# EAGLE schematic main (EAGLE 9.6.2)

## Sheet 1 of 5: Mains PFC
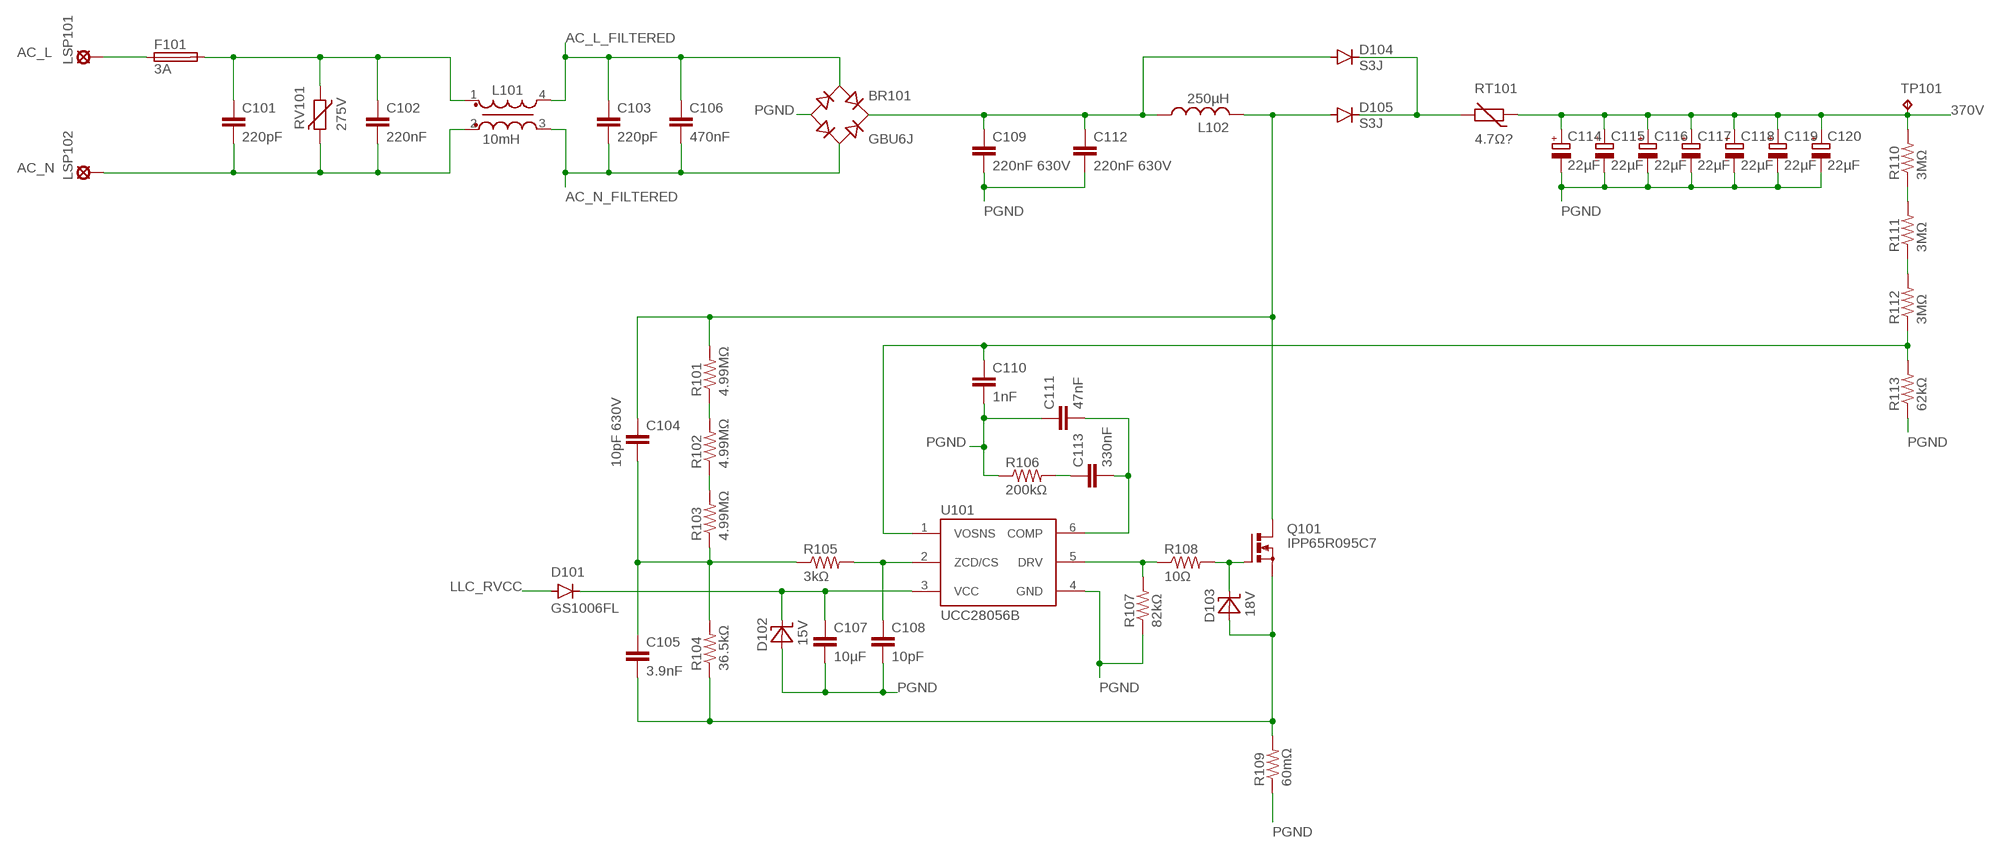
[diagram p0: schematic, sheet 1]

### Parts
BR101  GBU6J  [GBU6]
C101  220pF  C-EU-10MM-TH  [C-10MM-TH]
C102  220nF  WCAP-FTX2-220N  [WCAP-FTX2-220N]
C103  220pF  C-EU-10MM-TH  [C-10MM-TH]
C104  10pF 630V  C-EUC1206  [C1206]
C105  3.9nF  C-EUC0603  [C0603]
C106  470nF  WCAP-FTX2-470N  [WCAP-FTX2-470N]
C107  10µF  C-EUC0805  [C0805]
C108  10pF  C-EUC0603  [C0603]
C109  220nF 630V  C-EUC1812  [C1812]
C110  1nF  C-EUC0603  [C0603]
C111  47nF  C-EUC0603  [C0603]
C112  220nF 630V  C-EUC1812  [C1812]
C113  330nF  C-EUC0603  [C0603]
C114  22µF  CPOL-E5-12.5  [E5-12.5]
C115  22µF  CPOL-E5-12.5  [E5-12.5]
C116  22µF  CPOL-E5-12.5  [E5-12.5]
C117  22µF  CPOL-E5-12.5  [E5-12.5]
C118  22µF  CPOL-E5-12.5  [E5-12.5]
C119  22µF  CPOL-E5-12.5  [E5-12.5]
C120  22µF  CPOL-E5-12.5  [E5-12.5]
D101  GS1006FL  SOD123FL-DIODE  [SOD123FL]
D102  15V  SOD123-ZENER  [SOD123]
D103  18V  SOD123-ZENER  [SOD123]
D104  S3J  DIODE-SMC  [SMC]
D105  S3J  DIODE-SMC  [SMC]
F101  3A  MRF_FUSE  [MRF_FUSE]
L101  10mH  WE-CMB_M_744823210  [WE-CMB_M]
L102  250µH  ATCA-08  [ATCA-08]
LSP101  AC_L  LSP13  [LSP13]
LSP102  AC_N  LSP13  [LSP13]
Q101  IPP65R095C7  TO220BV-HS1-N-MOSFET  [TO220BV-HS1]
R101  4.99MΩ  R-US_R1206  [R1206]
R102  4.99MΩ  R-US_R1206  [R1206]
R103  4.99MΩ  R-US_R1206  [R1206]
R104  36.5kΩ  R-US_R0603  [R0603]
R105  3kΩ  R-US_R0603  [R0603]
R106  200kΩ  R-US_R0603  [R0603]
R107  82kΩ  R-US_R0603  [R0603]
R108  10Ω  R-US_R0603  [R0603]
R109  60mΩ  R-US_R1206  [R1206]
R110  3MΩ  R-US_R1206  [R1206]
R111  3MΩ  R-US_R1206  [R1206]
R112  3MΩ  R-US_R1206  [R1206]
R113  62kΩ  R-US_R0603  [R0603]
RT101  4.7Ω?  THERMISTOR-5  [R-5]
RV101  275V  B72207S0271  [B72207S0271]
TP101  RCU-0(J)  [TP_0603_JOINED]
U101  UCC28056B  [SOT23-6L]

### Nets
370V [HV]: C114.+ C115.+ C116.+ C117.+ C118.+ C119.+ C120.+ R110.2 RT101.1 TP101.1(TP) ; also sheet 2
AC_L [HV]: F101.1 LSP101.MP
AC_L_FILTERED [HV]: BR101.2(AC1) C103.1 C106.1 L101.4 ; also sheet 2
AC_L_FUSED [HV]: C101.1 C102.1 F101.2 L101.1 RV101.1
AC_N [HV]: C101.2 C102.2 L101.2 LSP102.MP RV101.2
AC_N_FILTERED [HV]: BR101.3(AC2) C103.2 C106.2 L101.3 ; also sheet 2
AC_RECTIFIED [HV]: BR101.4(+) C109.1 C112.1 D104.A L102.1
LLC_RVCC [primary]: D101.A ; also sheet 2
PFC_COMP [primary]: C111.2 C113.2 U101.6(COMP)
PFC_COMP_INT [primary]: C113.1 R106.2
PFC_CS [primary]: C105.2 D103.A Q101.S R104.1 R109.2
PFC_DRV [primary]: R107.2 R108.1 U101.5(DRV)
PFC_DRV_R [primary]: D103.C Q101.G R108.2
PFC_OUT_RAW [HV]: D104.C D105.C RT101.2
PFC_SW_NODE [HV]: C104.1 D105.A L102.2 Q101.D R101.2
PFC_VCC [primary]: C107.1 D101.C D102.C U101.3(VCC)
PFC_VOSNS [primary]: C110.1 R112.1 R113.2 U101.1(VOSNS)
PFC_VOSNS_RB [HV]: R111.1 R112.2
PFC_VOSNS_RT [HV]: R110.1 R111.2
PFC_ZCD/CS [primary]: C108.1 R105.2 U101.2(ZCD/CS)
PFC_ZCD/CS_RAW [primary]: C104.2 C105.1 R103.1 R104.2 R105.1
PFC_ZCD_RB [HV]: R102.1 R103.2
PFC_ZCD_RT [HV]: R101.1 R102.2
PGND [primary]: BR101.1(-) C107.2 C108.2 C109.2 C110.2 C111.1 C112.2 C114.- C115.- C116.- C117.- C118.- C119.- C120.- D102.A R106.1 R107.1 R109.1 R113.1 U101.4(GND) ; also sheet 2

## Sheet 2 of 5: LLC
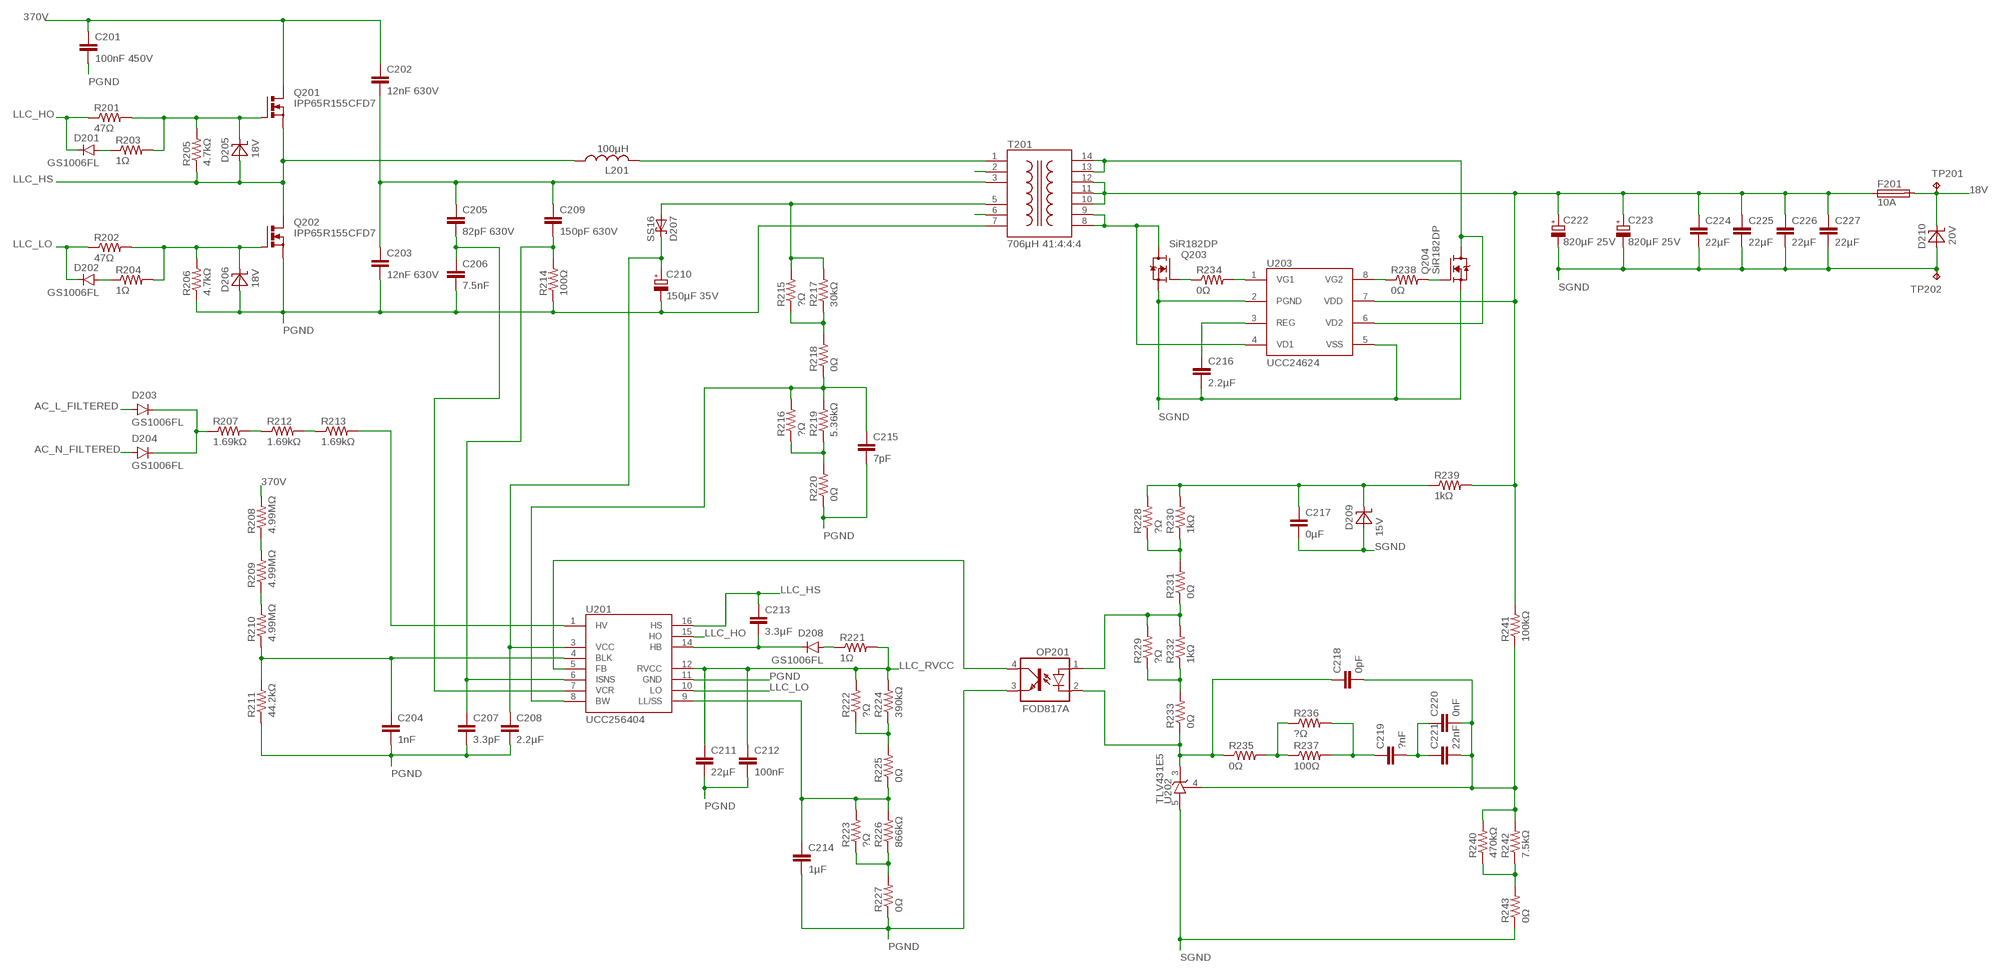
[diagram p1: schematic, sheet 2]

### Parts
C201  100nF 450V  C-EUC1206  [C1206]
C202  12nF 630V  C-EUC1210  [C1210]
C203  12nF 630V  C-EUC1210  [C1210]
C204  1nF  C-EUC0603  [C0603]
C205  82pF 630V  C-EUC1206  [C1206]
C206  7.5nF  C-EUC0603  [C0603]
C207  3.3pF  C-EUC0603  [C0603]
C208  2.2µF  C-EUC0805  [C0805]
C209  150pF 630V  C-EUC1206  [C1206]
C210  150µF 35V  CPOL-EUE  [PANASONIC_E]
C211  22µF  C-EUC0805  [C0805]
C212  100nF  C-EUC0603  [C0603]
C213  3.3µF  C-EUC0805  [C0805]
C214  1µF  C-EUC0603  [C0603]
C215  7pF  C-EUC0603  [C0603]
C216  2.2µF  C-EUC0805  [C0805]
C217  0µF  C-EUC0603  [C0603]
C218  0pF  C-EUC0603  [C0603]
C219  ?nF  C-EUC0603  [C0603]
C220  0nF  C-EUC0603  [C0603]
C221  22nF  C-EUC0603  [C0603]
C222  820µF 25V  CPOL-EUE5-10.5  [E5-10,5]
C223  820µF 25V  CPOL-EUE5-10.5  [E5-10,5]
C224  22µF  C-EUC0805  [C0805]
C225  22µF  C-EUC0805  [C0805]
C226  22µF  C-EUC0805  [C0805]
C227  22µF  C-EUC0805  [C0805]
D201  GS1006FL  SOD123FL-DIODE  [SOD123FL]
D202  GS1006FL  SOD123FL-DIODE  [SOD123FL]
D203  GS1006FL  SOD123FL-DIODE  [SOD123FL]
D204  GS1006FL  SOD123FL-DIODE  [SOD123FL]
D205  18V  SOD123-ZENER  [SOD123]
D206  18V  SOD123-ZENER  [SOD123]
D207  SS16  DO-214AC-SCHOTTKY  [DO-214AC]
D208  GS1006FL  SOD123FL-DIODE  [SOD123FL]
D209  15V  SOD123-ZENER  [SOD123]
D210  20V  SOD123-ZENER  [SOD123]
F201  10A  MRF_FUSE  [MRF_FUSE]
L201  100µH  HCTI-1MM  [HCTI-1MM]
OP201  FOD817A  DIP4-OPTOCOUPLER  [DIP4]
Q201  IPP65R155CFD7  TO220BV-HS1-N-MOSFET  [TO220BV-HS1]
Q202  IPP65R155CFD7  TO220BV-HS1-N-MOSFET  [TO220BV-HS1]
Q203  SiR182DP  POWERPAK-SO8-N-MOSFET  [POWERPAK-SO8]
Q204  SiR182DP  POWERPAK-SO8-N-MOSFET  [POWERPAK-SO8]
R201  47Ω  R-US_R0603  [R0603]
R202  47Ω  R-US_R0603  [R0603]
R203  1Ω  R-US_R0603  [R0603]
R204  1Ω  R-US_R0603  [R0603]
R205  4.7kΩ  R-US_R0603  [R0603]
R206  4.7kΩ  R-US_R0603  [R0603]
R207  1.69kΩ  R-US_R1206  [R1206]
R208  4.99MΩ  R-US_R1206  [R1206]
R209  4.99MΩ  R-US_R1206  [R1206]
R210  4.99MΩ  R-US_R1206  [R1206]
R211  44.2kΩ  R-US_R0603  [R0603]
R212  1.69kΩ  R-US_R1206  [R1206]
R213  1.69kΩ  R-US_R1206  [R1206]
R214  100Ω  R-US_R1206  [R1206]
R215  ?Ω  R-US_R0603  [R0603]
R216  ?Ω  R-US_R0603  [R0603]
R217  30kΩ  R-US_R0603  [R0603]
R218  0Ω  R-US_R0603  [R0603]
R219  5.36kΩ  R-US_R0603  [R0603]
R220  0Ω  R-US_R0603  [R0603]
R221  1Ω  R-US_R0603  [R0603]
R222  ?Ω  R-US_R0603  [R0603]
R223  ?Ω  R-US_R0603  [R0603]
R224  390kΩ  R-US_R0603  [R0603]
R225  0Ω  R-US_R0603  [R0603]
R226  866kΩ  R-US_R0603  [R0603]
R227  0Ω  R-US_R0603  [R0603]
R228  ?Ω  R-US_R0603  [R0603]
R229  ?Ω  R-US_R0603  [R0603]
R230  1kΩ  R-US_R0603  [R0603]
R231  0Ω  R-US_R0603  [R0603]
R232  1kΩ  R-US_R0603  [R0603]
R233  0Ω  R-US_R0603  [R0603]
R234  0Ω  R-US_R0603  [R0603]
R235  0Ω  R-US_R0603  [R0603]
R236  ?Ω  R-US_R0603  [R0603]
R237  100Ω  R-US_R0603  [R0603]
R238  0Ω  R-US_R0603  [R0603]
R239  1kΩ  R-US_R0603  [R0603]
R240  470kΩ  R-US_R0603  [R0603]
R241  100kΩ  R-US_R0603  [R0603]
R242  7.5kΩ  R-US_R0603  [R0603]
R243  0Ω  R-US_R0603  [R0603]
T201  706µH 41:4:4:4  ETD29/16/10-H  [ETD29/16/10-H]
TP201  RCU-0(J)  [TP_0603_JOINED]
TP202  RCU-0(J)  [TP_0603_JOINED]
U201  UCC256404  [SOIC16-NO2,13]
U202  TLV431E5  [SOT23-5L]
U203  UCC24624  [SOIC8]

### Nets
18V: D210.C F201.2 TP201.1(TP) ; also sheet 3,4,5
370V [HV]: C201.1 C202.1 Q201.D R208.2 ; also sheet 1
AC_L_FILTERED [HV]: D203.A ; also sheet 1
AC_N_FILTERED [HV]: D204.A ; also sheet 1
LLC_AUX [primary]: D207.A R215.2 R217.2 T201.5
LLC_BLK [primary]: C204.1 R210.1 R211.2 U201.4(BLK)
LLC_BLK_RB [HV]: R209.1 R210.2
LLC_BLK_RT [HV]: R208.1 R209.2
LLC_BW [primary]: C215.1 R216.2 R218.1 R219.2 U201.8(BW)
LLC_BW_RB [primary]: R216.1 R219.1 R220.2
LLC_BW_RT [primary]: R215.1 R217.1 R218.2
LLC_FB [primary]: OP201.4(COL) U201.5(FB)
LLC_FB_COMP: C219.1 R236.2 R237.2
LLC_FB_COMPC: C219.2 C220.1 C221.1
LLC_FB_COMPR: R235.2 R236.1 R237.1
LLC_FB_OPA: OP201.1(A) R229.2 R231.1 R232.2
LLC_FB_OPAP: C217.1 D209.C R228.2 R230.2 R239.1
LLC_FB_OPAR: R228.1 R230.1 R231.2
LLC_FB_OPBR: R229.1 R232.1 R233.2
LLC_FB_OPK: C218.1 OP201.2(C) R233.1 R235.1 U202.3(C)
LLC_FB_VREF: C218.2 C220.2 C221.2 R240.2 R241.1 R242.2 U202.4(R)
LLC_FB_VREFR: R240.1 R242.1 R243.2
LLC_HB [HV]: C213.2 D208.C U201.14(HB)
LLC_HB_FEED [primary]: D208.A R221.1
LLC_HO [HV]: D201.C R201.1 U201.15(HO)
LLC_HO_DIS [HV]: D201.A R203.1
LLC_HO_R [HV]: D205.C Q201.G R201.2 R203.2 R205.2
LLC_HS [HV]: C213.1 D205.A L201.1 Q201.S Q202.D R205.1 U201.16(HS)
LLC_HV [HV]: R213.2 U201.1(HV)
LLC_HV_RB [HV]: R212.2 R213.1
LLC_HV_RECT [HV]: D203.C D204.C R207.1
LLC_HV_RT [HV]: R207.2 R212.1
LLC_ISNS [primary]: C207.1 C209.2 R214.2 U201.6(ISNS)
LLC_LL/SS [primary]: C214.1 R223.2 R225.1 R226.2 U201.9(LL/SS)
LLC_LL_RB [primary]: R223.1 R226.1 R227.2
LLC_LL_RT [primary]: R222.1 R224.1 R225.2
LLC_LO [primary]: D202.C R202.1 U201.10(LO)
LLC_LO_DIS [primary]: D202.A R204.1
LLC_LO_R [primary]: D206.C Q202.G R202.2 R204.2 R206.2
LLC_OUT: C222.+ C223.+ C224.1 C225.1 C226.1 C227.1 F201.1 R239.2 R241.2 T201.10 T201.11 T201.12 U203.7(VDD)
LLC_PRI_IN [HV]: L201.2 T201.1
LLC_PRI_OUT [HV]: C202.2 C203.1 C205.1 C209.1 T201.3
LLC_RVCC [primary]: C211.1 C212.1 R221.2 R222.2 R224.2 U201.12(RVCC) ; also sheet 1
LLC_SR_REG: C216.1 U203.3(REG)
LLC_SR_VD1: Q203.5-8(D) T201.8 T201.9 U203.4(VD1)
LLC_SR_VD2: Q204.5-8(D) T201.13 T201.14 U203.6(VD2)
LLC_SR_VG1: R234.2 U203.1(VG1)
LLC_SR_VG1_R: Q203.4(G) R234.1
LLC_SR_VG2: R238.1 U203.8(VG2)
LLC_SR_VG2_R: Q204.4(G) R238.2
LLC_VCC [primary]: C208.1 C210.+ D207.C U201.3(VCC)
LLC_VCR [primary]: C205.2 C206.1 U201.7(VCR)
PGND [primary]: C201.2 C203.2 C204.2 C206.2 C207.2 C208.2 C210.- C211.2 C212.2 C214.2 C215.2 D206.A OP201.3(EMIT) Q202.S R206.1 R211.1 R214.1 R220.1 R227.1 T201.7 U201.11(GND) ; also sheet 1
PRI_DUMMY_1 [HV]: T201.2
PRI_DUMMY_2 [primary]: T201.6
SGND: C216.2 C217.2 C222.- C223.- C224.2 C225.2 C226.2 C227.2 D209.A D210.A Q203.1(S) Q203.2(S) Q203.3(S) Q204.1(S) Q204.2(S) Q204.3(S) R243.1 TP202.1(TP) U202.5(A) U203.2(PGND) U203.5(VSS) ; also sheet 3,4,5

## Sheet 3 of 5: USB-C Port 1
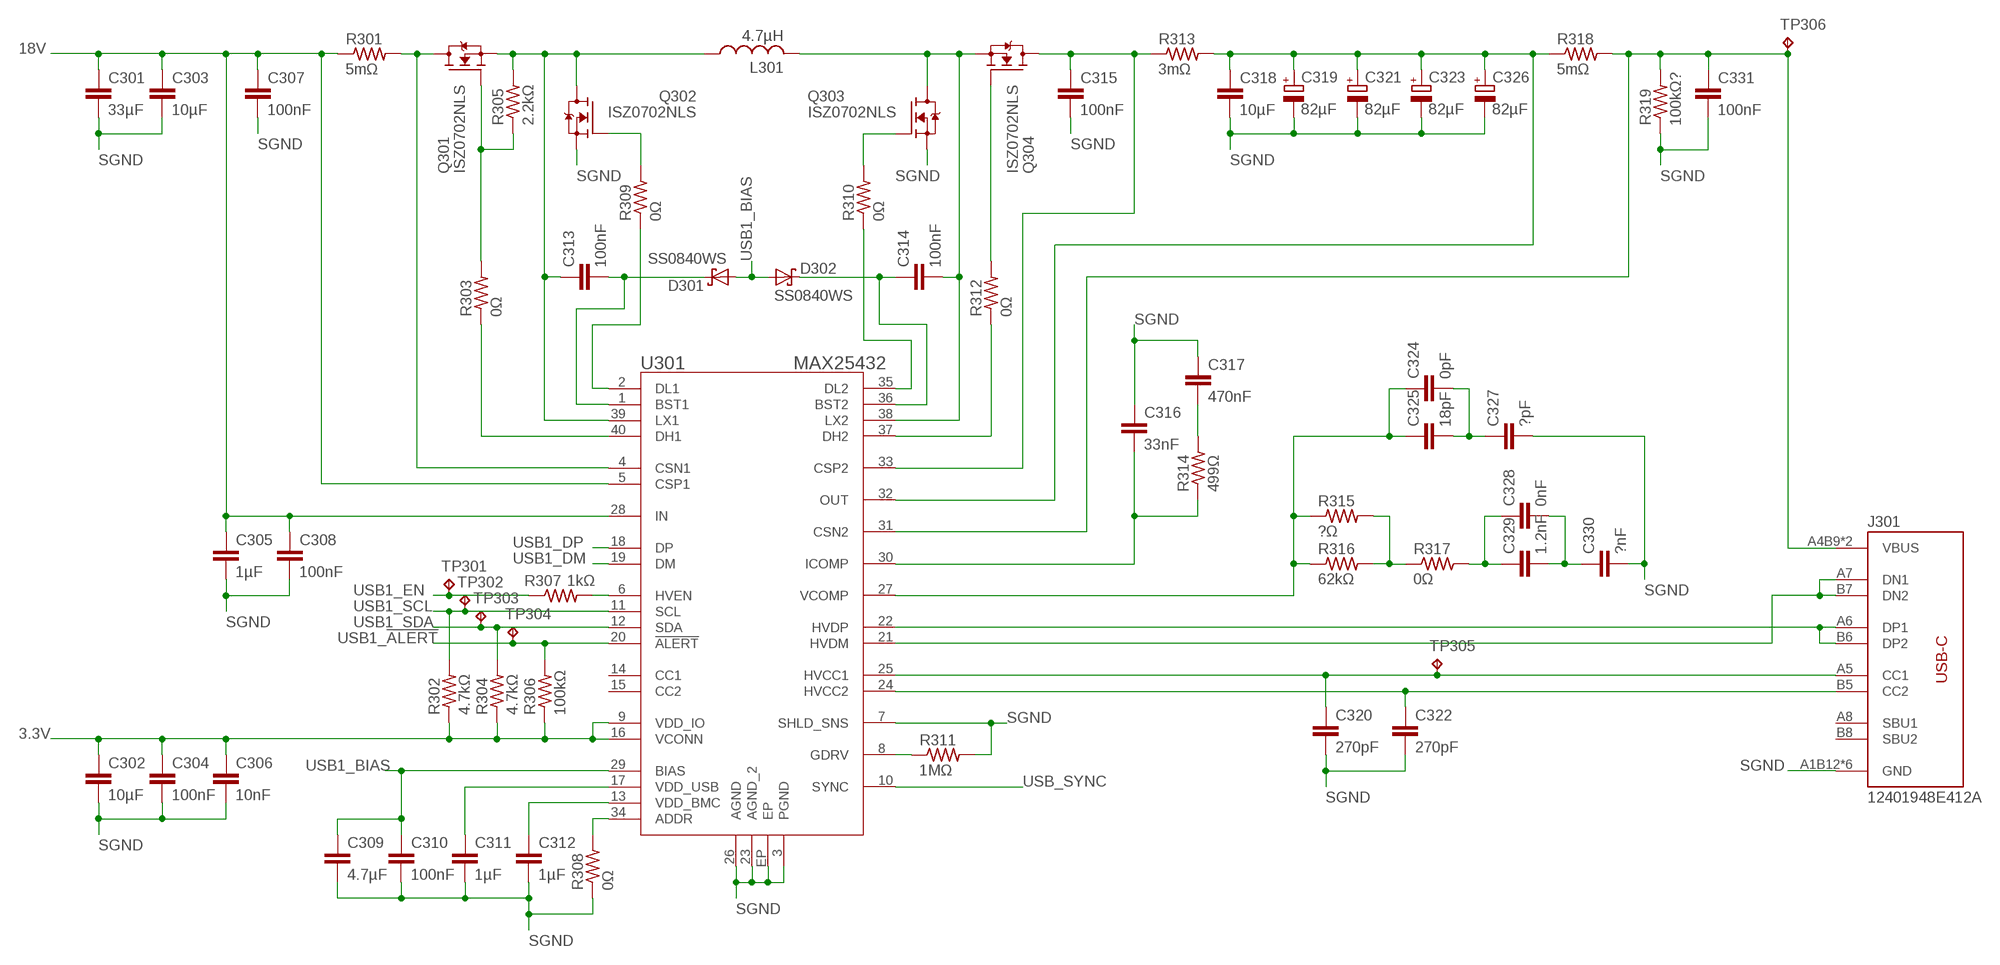
[diagram p2: schematic, sheet 3]

### Parts
C301  33µF  C-EUC1206  [C1206]
C302  10µF  C-EUC0805  [C0805]
C303  10µF  C-EUC0805  [C0805]
C304  100nF  C-EUC0603  [C0603]
C305  1µF  C-EUC0603  [C0603]
C306  10nF  C-EUC0603  [C0603]
C307  100nF  C-EUC0603  [C0603]
C308  100nF  C-EUC0603  [C0603]
C309  4.7µF  C-EUC0603  [C0603]
C310  100nF  C-EUC0603  [C0603]
C311  1µF  C-EUC0603  [C0603]
C312  1µF  C-EUC0603  [C0603]
C313  100nF  C-EUC0603  [C0603]
C314  100nF  C-EUC0603  [C0603]
C315  100nF  C-EUC0603  [C0603]
C316  33nF  C-EUC0603  [C0603]
C317  470nF  C-EUC0603  [C0603]
C318  10µF  C-EUC0805  [C0805]
C319  82µF  CPOL-EUE3.5-8  [E3,5-8]
C320  270pF  C-EUC0603  [C0603]
C321  82µF  CPOL-EUE3.5-8  [E3,5-8]
C322  270pF  C-EUC0603  [C0603]
C323  82µF  CPOL-EUE3.5-8  [E3,5-8]
C324  0pF  C-EUC0603  [C0603]
C325  18pF  C-EUC0603  [C0603]
C326  82µF  CPOL-EUE3.5-8  [E3,5-8]
C327  ?pF  C-EUC0603  [C0603]
C328  0nF  C-EUC0603  [C0603]
C329  1.2nF  C-EUC0603  [C0603]
C330  ?nF  C-EUC0603  [C0603]
C331  100nF  C-EUC0603  [C0603]
D301  SS0840WS  SOD323-SCHOTTKY  [SOD323]
D302  SS0840WS  SOD323-SCHOTTKY  [SOD323]
J301  12401948E412A  [12401948E412A]
L301  4.7µH  B82559BA016  [B82559B*A016]
Q301  ISZ0702NLS  TSDSON-8-N-MOSFET  [TSDSON-8]
Q302  ISZ0702NLS  TSDSON-8-N-MOSFET  [TSDSON-8]
Q303  ISZ0702NLS  TSDSON-8-N-MOSFET  [TSDSON-8]
Q304  ISZ0702NLS  TSDSON-8-N-MOSFET  [TSDSON-8]
R301  5mΩ  R-US_R0805  [R0805]
R302  4.7kΩ  R-US_R0603  [R0603]
R303  0Ω  R-US_R0603  [R0603]
R304  4.7kΩ  R-US_R0603  [R0603]
R305  2.2kΩ  R-US_R0603  [R0603]
R306  100kΩ  R-US_R0603  [R0603]
R307  1kΩ  R-US_R0603  [R0603]
R308  0Ω  R-US_R0603  [R0603]
R309  0Ω  R-US_R0603  [R0603]
R310  0Ω  R-US_R0603  [R0603]
R311  1MΩ  R-US_R0603  [R0603]
R312  0Ω  R-US_R0603  [R0603]
R313  3mΩ  R-US_R0805  [R0805]
R314  499Ω  R-US_R0603  [R0603]
R315  ?Ω  R-US_R0603  [R0603]
R316  62kΩ  R-US_R0603  [R0603]
R317  0Ω  R-US_R0603  [R0603]
R318  5mΩ  R-US_R0805  [R0805]
R319  100kΩ?  R-US_R0603  [R0603]
TP301  RCU-0(J)  [TP_0603_JOINED]
TP302  RCU-0(J)  [TP_0603_JOINED]
TP303  RCU-0(J)  [TP_0603_JOINED]
TP304  RCU-0(J)  [TP_0603_JOINED]
TP305  RCU-0(J)  [TP_0603_JOINED]
TP306  RCU-0(J)  [TP_0603_JOINED]
U301  MAX25432  [TQFN-40]

### Nets
3.3V: C302.1 C304.1 C306.1 R302.1 R304.1 R306.1 U301.9(VDD_IO) U301.16(VCONN) ; also sheet 4,5
18V: C301.1 C303.1 C305.1 C307.1 C308.1 R301.1 U301.5(CSP1) U301.28(IN) ; also sheet 2,4,5
SGND: C301.2 C302.2 C303.2 C304.2 C305.2 C306.2 C307.2 C308.2 C309.2 C310.2 C311.2 C312.2 C315.2 C316.1 C317.1 C318.2 C319.- C320.2 C321.- C322.2 C323.- C326.- C327.2 C330.2 C331.2 J301.A1B12(GND) J301.B1A12(GND) J301.M1(GND) J301.M2(GND) J301.M3(GND) J301.M4(GND) Q302.1(S) Q302.2(S) Q302.3(S) Q303.1(S) Q303.2(S) Q303.3(S) R308.1 R311.2 R319.1 U301.3(PGND) U301.7(SHLD_SNS) U301.23(AGND_2) U301.26(AGND) U301.EP ; also sheet 2,4,5
USB1_!ALERT: R306.2 TP304.1(TP) U301.20(!ALERT) ; also sheet 5
USB1_ADDR: R308.2 U301.34(ADDR)
USB1_BIAS: C309.1 C310.1 D301.2(A) D302.2(A) U301.29(BIAS)
USB1_BST1: C313.2 D301.1(C) U301.1(BST1)
USB1_BST2: C314.1 D302.1(C) U301.36(BST2)
USB1_CC1: C320.1 J301.A5(CC1) TP305.1(TP) U301.25(HVCC1)
USB1_CC2: C322.1 J301.B5(CC2) U301.24(HVCC2)
USB1_CSN1: Q301.5-8(D) R301.2 U301.4(CSN1)
USB1_CSP2: C315.1 Q304.5-8(D) R313.1 U301.33(CSP2)
USB1_DH1: R303.1 U301.40(DH1)
USB1_DH1_R: Q301.4(G) R303.2 R305.1
USB1_DH2: R312.1 U301.37(DH2)
USB1_DH2_R: Q304.4(G) R312.2
USB1_DL1: R309.1 U301.2(DL1)
USB1_DL1_R: Q302.4(G) R309.2
USB1_DL2: R310.1 U301.35(DL2)
USB1_DL2_R: Q303.4(G) R310.2
USB1_DM: U301.19(DM) ; also sheet 5
USB1_DP: U301.18(DP) ; also sheet 5
USB1_EN: R307.1 TP301.1(TP) ; also sheet 5
USB1_GDRV: R311.1 U301.8(GDRV)
USB1_HVDM: J301.A7(DN1) J301.B7(DN2) U301.21(HVDM)
USB1_HVDP: J301.A6(DP1) J301.B6(DP2) U301.22(HVDP)
USB1_HVEN: R307.2 U301.6(HVEN)
USB1_ICOMP: C316.2 R314.1 U301.30(ICOMP)
USB1_ICOMP_R: C317.2 R314.2
USB1_LX1: C313.1 L301.1 Q301.1(S) Q301.2(S) Q301.3(S) Q302.5-8(D) R305.2 U301.39(LX1)
USB1_LX2: C314.2 L301.2 Q303.5-8(D) Q304.1(S) Q304.2(S) Q304.3(S) U301.38(LX2)
USB1_OUT: C318.1 C319.+ C321.+ C323.+ C326.+ R313.2 R318.1 U301.32(OUT)
USB1_SCL: R302.2 TP302.1(TP) U301.11(SCL) ; also sheet 5
USB1_SDA: R304.2 TP303.1(TP) U301.12(SDA) ; also sheet 5
USB1_VBUS: C331.1 J301.A4B9(VBUS) J301.B4A9(VBUS) R318.2 R319.2 TP306.1(TP) U301.31(CSN2)
USB1_VCOMP: C324.1 C325.1 R315.1 R316.1 U301.27(VCOMP)
USB1_VCOMP_CPI: C324.2 C325.2 C327.1
USB1_VCOMP_CZI: C328.2 C329.2 C330.1
USB1_VCOMP_R: C328.1 C329.1 R317.2
USB1_VCOMP_RI: R315.2 R316.2 R317.1
USB1_VDD_BMC: C312.1 U301.13(VDD_BMC)
USB1_VDD_USB: C311.1 U301.17(VDD_USB)
USB_SYNC: U301.10(SYNC) ; also sheet 4
Unconnected: J301.A8(SBU1) J301.B8(SBU2) U301.14(CC1) U301.15(CC2)

## Sheet 4 of 5: USB-C Port 2
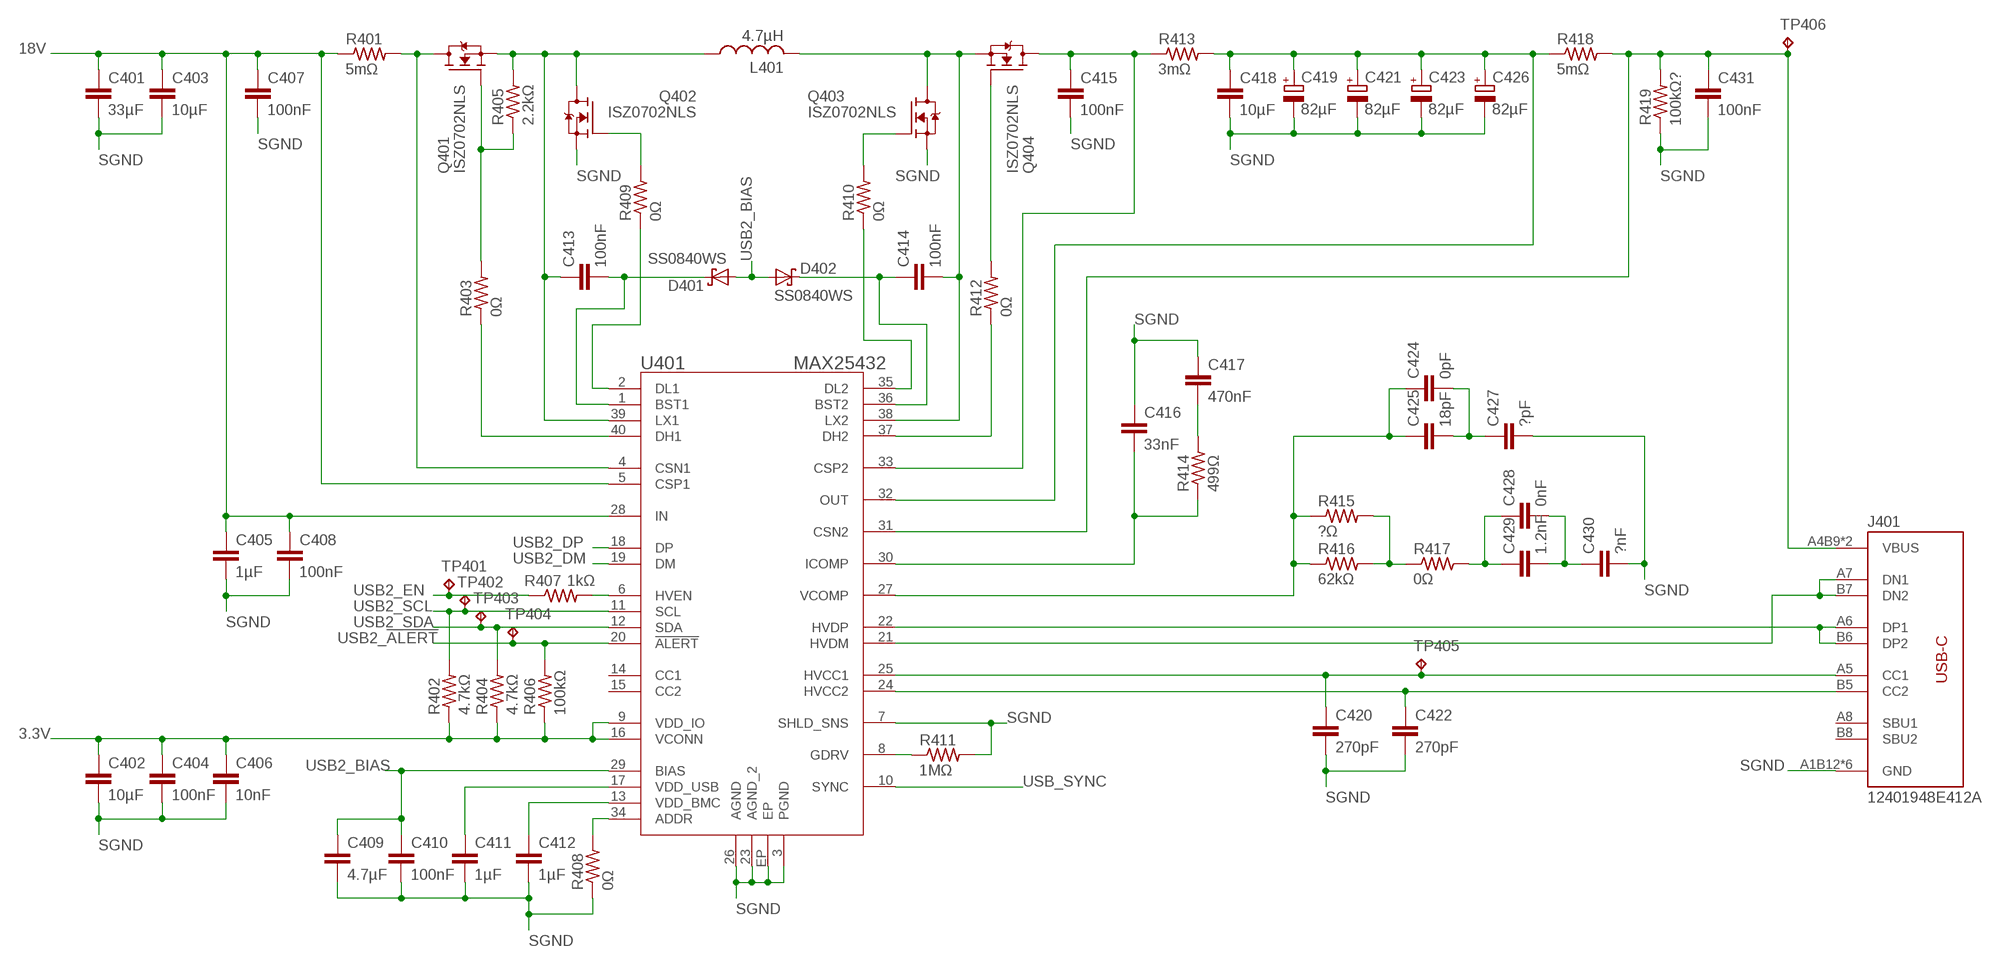
[diagram p3: schematic, sheet 4]

### Parts
C401  33µF  C-EUC1206  [C1206]
C402  10µF  C-EUC0805  [C0805]
C403  10µF  C-EUC0805  [C0805]
C404  100nF  C-EUC0603  [C0603]
C405  1µF  C-EUC0603  [C0603]
C406  10nF  C-EUC0603  [C0603]
C407  100nF  C-EUC0603  [C0603]
C408  100nF  C-EUC0603  [C0603]
C409  4.7µF  C-EUC0603  [C0603]
C410  100nF  C-EUC0603  [C0603]
C411  1µF  C-EUC0603  [C0603]
C412  1µF  C-EUC0603  [C0603]
C413  100nF  C-EUC0603  [C0603]
C414  100nF  C-EUC0603  [C0603]
C415  100nF  C-EUC0603  [C0603]
C416  33nF  C-EUC0603  [C0603]
C417  470nF  C-EUC0603  [C0603]
C418  10µF  C-EUC0805  [C0805]
C419  82µF  CPOL-EUE3.5-8  [E3,5-8]
C420  270pF  C-EUC0603  [C0603]
C421  82µF  CPOL-EUE3.5-8  [E3,5-8]
C422  270pF  C-EUC0603  [C0603]
C423  82µF  CPOL-EUE3.5-8  [E3,5-8]
C424  0pF  C-EUC0603  [C0603]
C425  18pF  C-EUC0603  [C0603]
C426  82µF  CPOL-EUE3.5-8  [E3,5-8]
C427  ?pF  C-EUC0603  [C0603]
C428  0nF  C-EUC0603  [C0603]
C429  1.2nF  C-EUC0603  [C0603]
C430  ?nF  C-EUC0603  [C0603]
C431  100nF  C-EUC0603  [C0603]
D401  SS0840WS  SOD323-SCHOTTKY  [SOD323]
D402  SS0840WS  SOD323-SCHOTTKY  [SOD323]
J401  12401948E412A  [12401948E412A]
L401  4.7µH  B82559BA016  [B82559B*A016]
Q401  ISZ0702NLS  TSDSON-8-N-MOSFET  [TSDSON-8]
Q402  ISZ0702NLS  TSDSON-8-N-MOSFET  [TSDSON-8]
Q403  ISZ0702NLS  TSDSON-8-N-MOSFET  [TSDSON-8]
Q404  ISZ0702NLS  TSDSON-8-N-MOSFET  [TSDSON-8]
R401  5mΩ  R-US_R0805  [R0805]
R402  4.7kΩ  R-US_R0603  [R0603]
R403  0Ω  R-US_R0603  [R0603]
R404  4.7kΩ  R-US_R0603  [R0603]
R405  2.2kΩ  R-US_R0603  [R0603]
R406  100kΩ  R-US_R0603  [R0603]
R407  1kΩ  R-US_R0603  [R0603]
R408  0Ω  R-US_R0603  [R0603]
R409  0Ω  R-US_R0603  [R0603]
R410  0Ω  R-US_R0603  [R0603]
R411  1MΩ  R-US_R0603  [R0603]
R412  0Ω  R-US_R0603  [R0603]
R413  3mΩ  R-US_R0805  [R0805]
R414  499Ω  R-US_R0603  [R0603]
R415  ?Ω  R-US_R0603  [R0603]
R416  62kΩ  R-US_R0603  [R0603]
R417  0Ω  R-US_R0603  [R0603]
R418  5mΩ  R-US_R0805  [R0805]
R419  100kΩ?  R-US_R0603  [R0603]
TP401  RCU-0(J)  [TP_0603_JOINED]
TP402  RCU-0(J)  [TP_0603_JOINED]
TP403  RCU-0(J)  [TP_0603_JOINED]
TP404  RCU-0(J)  [TP_0603_JOINED]
TP405  RCU-0(J)  [TP_0603_JOINED]
TP406  RCU-0(J)  [TP_0603_JOINED]
U401  MAX25432  [TQFN-40]

### Nets
3.3V: C402.1 C404.1 C406.1 R402.1 R404.1 R406.1 U401.9(VDD_IO) U401.16(VCONN) ; also sheet 3,5
18V: C401.1 C403.1 C405.1 C407.1 C408.1 R401.1 U401.5(CSP1) U401.28(IN) ; also sheet 2,3,5
SGND: C401.2 C402.2 C403.2 C404.2 C405.2 C406.2 C407.2 C408.2 C409.2 C410.2 C411.2 C412.2 C415.2 C416.1 C417.1 C418.2 C419.- C420.2 C421.- C422.2 C423.- C426.- C427.2 C430.2 C431.2 J401.A1B12(GND) J401.B1A12(GND) J401.M1(GND) J401.M2(GND) J401.M3(GND) J401.M4(GND) Q402.1(S) Q402.2(S) Q402.3(S) Q403.1(S) Q403.2(S) Q403.3(S) R408.1 R411.2 R419.1 U401.3(PGND) U401.7(SHLD_SNS) U401.23(AGND_2) U401.26(AGND) U401.EP ; also sheet 2,3,5
USB2_!ALERT: R406.2 TP404.1(TP) U401.20(!ALERT) ; also sheet 5
USB2_ADDR: R408.2 U401.34(ADDR)
USB2_BIAS: C409.1 C410.1 D401.2(A) D402.2(A) U401.29(BIAS)
USB2_BST1: C413.2 D401.1(C) U401.1(BST1)
USB2_BST2: C414.1 D402.1(C) U401.36(BST2)
USB2_CC1: C420.1 J401.A5(CC1) TP405.1(TP) U401.25(HVCC1)
USB2_CC2: C422.1 J401.B5(CC2) U401.24(HVCC2)
USB2_CSN1: Q401.5-8(D) R401.2 U401.4(CSN1)
USB2_CSP2: C415.1 Q404.5-8(D) R413.1 U401.33(CSP2)
USB2_DH1: R403.1 U401.40(DH1)
USB2_DH1_R: Q401.4(G) R403.2 R405.1
USB2_DH2: R412.1 U401.37(DH2)
USB2_DH2_R: Q404.4(G) R412.2
USB2_DL1: R409.1 U401.2(DL1)
USB2_DL1_R: Q402.4(G) R409.2
USB2_DL2: R410.1 U401.35(DL2)
USB2_DL2_R: Q403.4(G) R410.2
USB2_DM: U401.19(DM) ; also sheet 5
USB2_DP: U401.18(DP) ; also sheet 5
USB2_EN: R407.1 TP401.1(TP) ; also sheet 5
USB2_GDRV: R411.1 U401.8(GDRV)
USB2_HVDM: J401.A7(DN1) J401.B7(DN2) U401.21(HVDM)
USB2_HVDP: J401.A6(DP1) J401.B6(DP2) U401.22(HVDP)
USB2_HVEN: R407.2 U401.6(HVEN)
USB2_ICOMP: C416.2 R414.1 U401.30(ICOMP)
USB2_ICOMP_R: C417.2 R414.2
USB2_LX1: C413.1 L401.1 Q401.1(S) Q401.2(S) Q401.3(S) Q402.5-8(D) R405.2 U401.39(LX1)
USB2_LX2: C414.2 L401.2 Q403.5-8(D) Q404.1(S) Q404.2(S) Q404.3(S) U401.38(LX2)
USB2_OUT: C418.1 C419.+ C421.+ C423.+ C426.+ R413.2 R418.1 U401.32(OUT)
USB2_SCL: R402.2 TP402.1(TP) U401.11(SCL) ; also sheet 5
USB2_SDA: R404.2 TP403.1(TP) U401.12(SDA) ; also sheet 5
USB2_VBUS: C431.1 J401.A4B9(VBUS) J401.B4A9(VBUS) R418.2 R419.2 TP406.1(TP) U401.31(CSN2)
USB2_VCOMP: C424.1 C425.1 R415.1 R416.1 U401.27(VCOMP)
USB2_VCOMP_CPI: C424.2 C425.2 C427.1
USB2_VCOMP_CZI: C428.2 C429.2 C430.1
USB2_VCOMP_R: C428.1 C429.1 R417.2
USB2_VCOMP_RI: R415.2 R416.2 R417.1
USB2_VDD_BMC: C412.1 U401.13(VDD_BMC)
USB2_VDD_USB: C411.1 U401.17(VDD_USB)
USB_SYNC: U401.10(SYNC) ; also sheet 3
Unconnected: J401.A8(SBU1) J401.B8(SBU2) U401.14(CC1) U401.15(CC2)

## Sheet 5 of 5
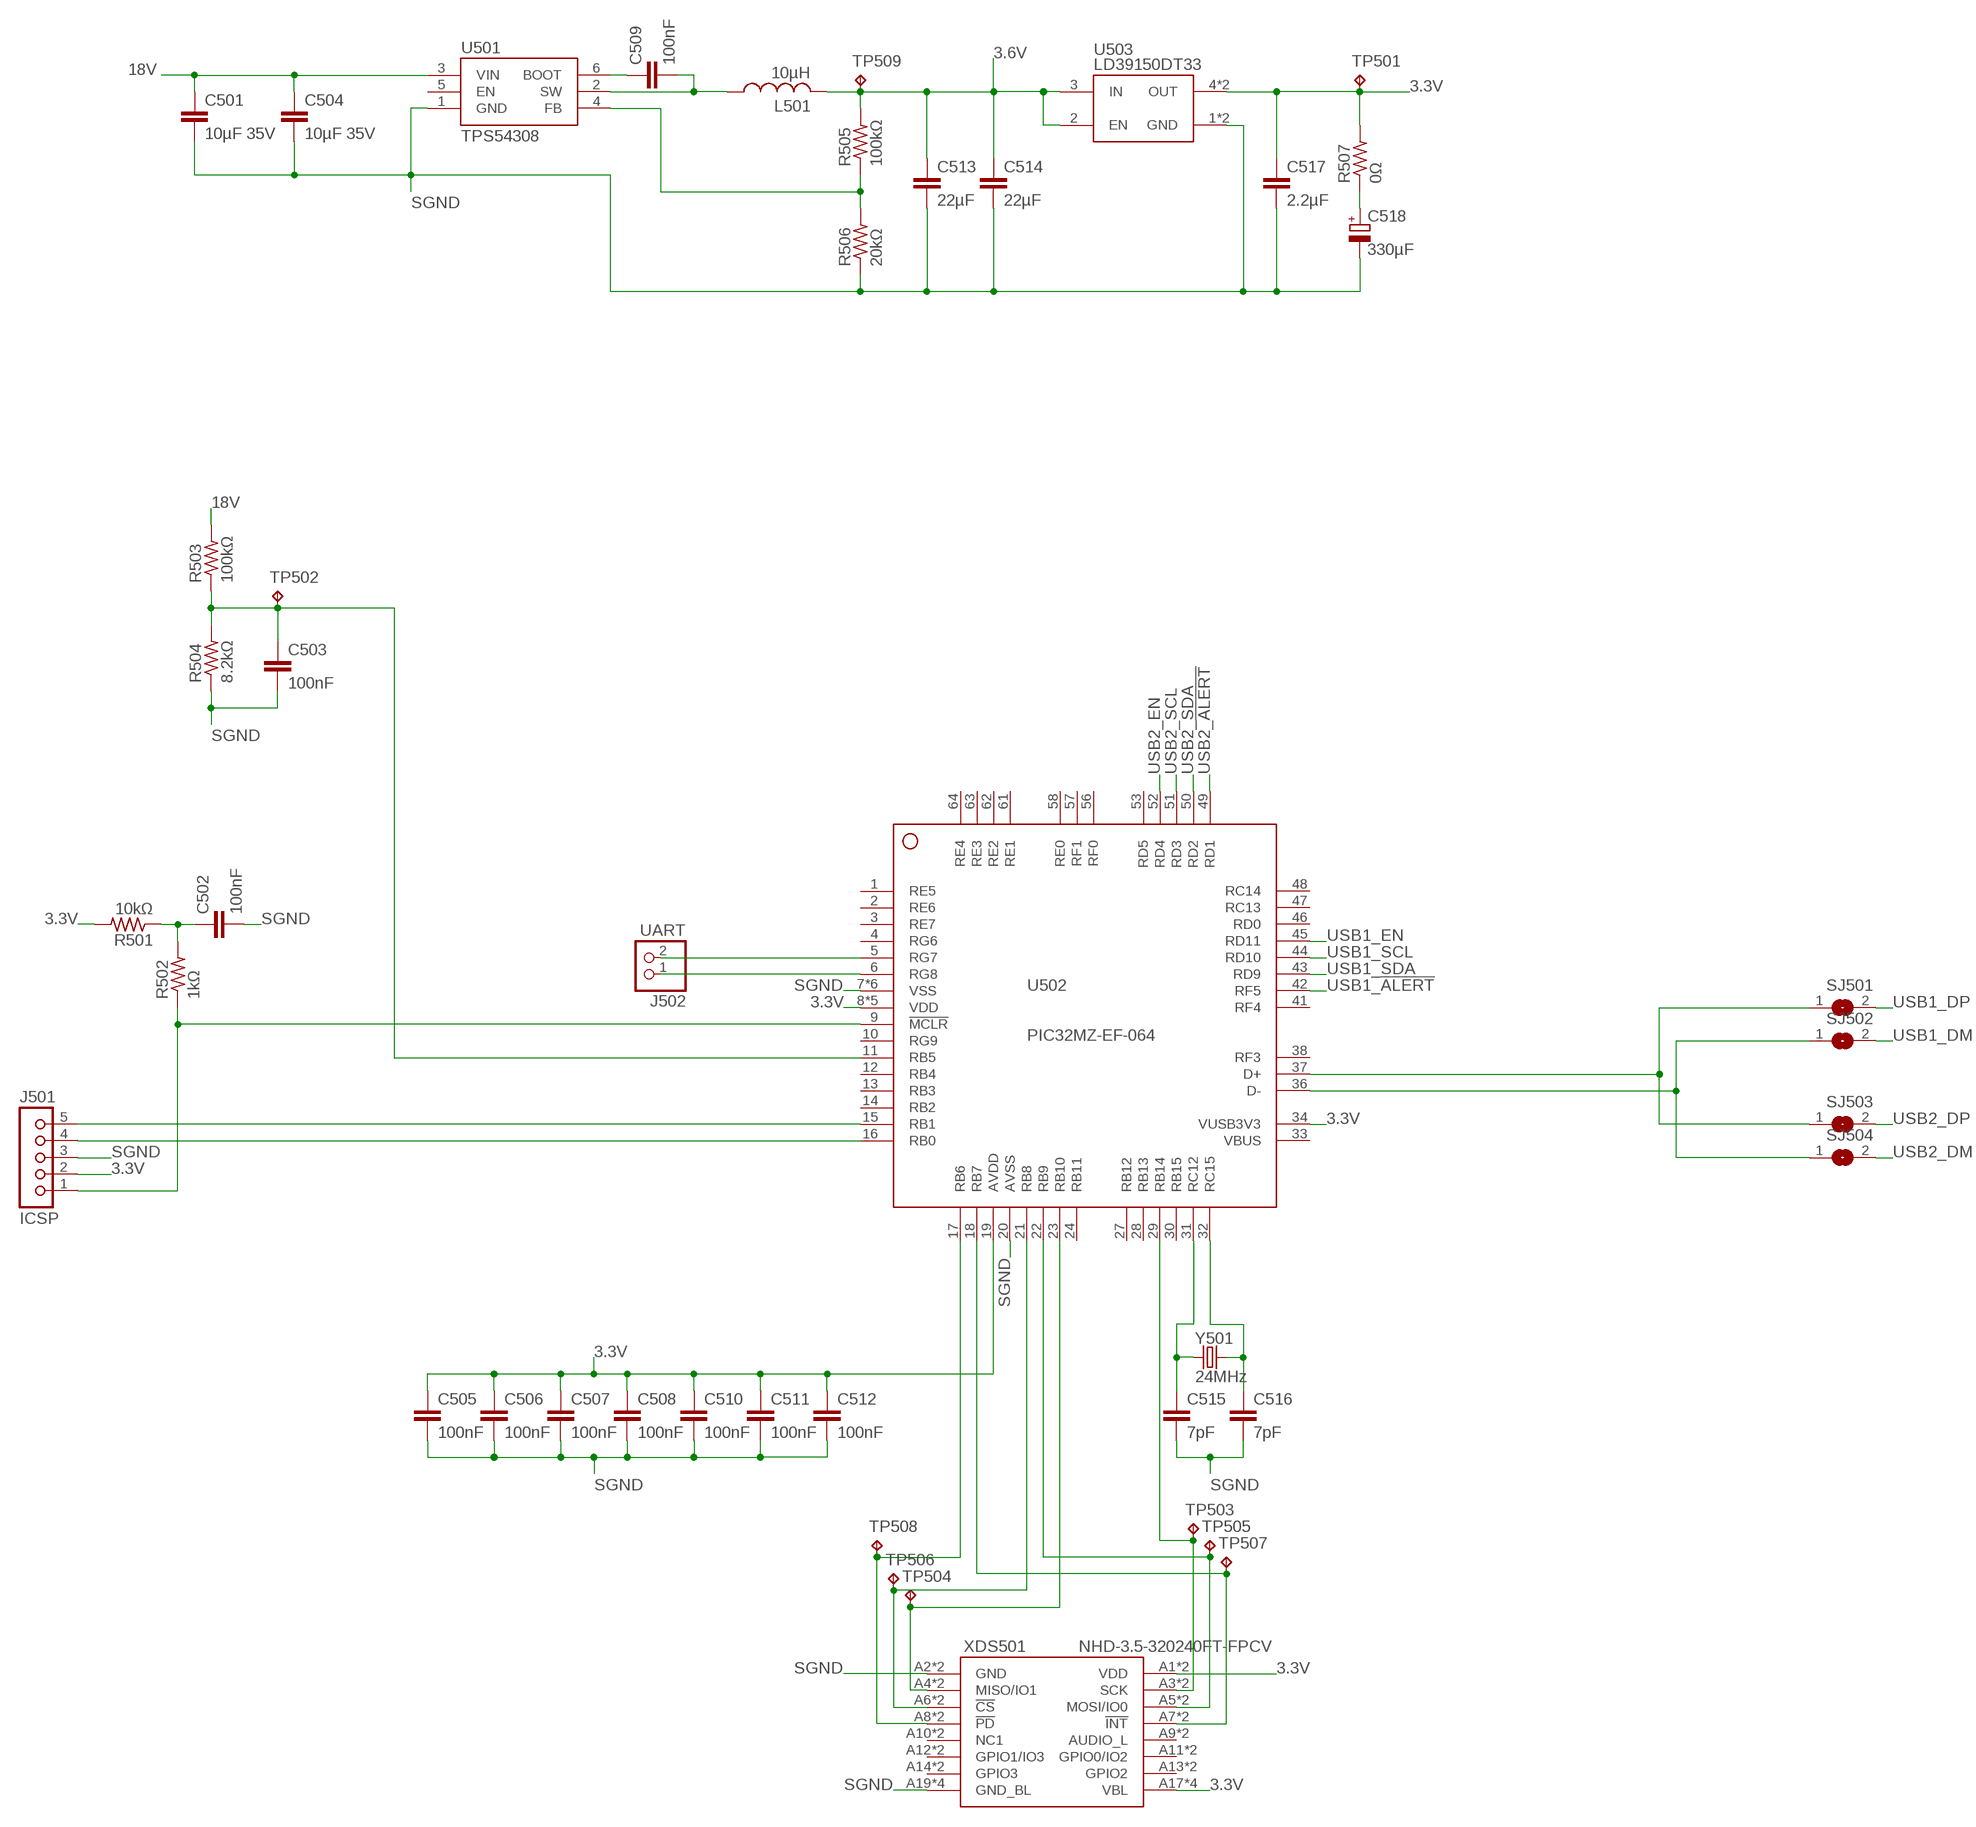
[diagram p4: schematic, sheet 5]

### Parts
C501  10µF 35V  C-EUC1206  [C1206]
C502  100nF  C-EUC0603  [C0603]
C503  100nF  C-EUC0603  [C0603]
C504  10µF 35V  C-EUC1206  [C1206]
C505  100nF  C-EUC0603  [C0603]
C506  100nF  C-EUC0603  [C0603]
C507  100nF  C-EUC0603  [C0603]
C508  100nF  C-EUC0603  [C0603]
C509  100nF  C-EUC0603  [C0603]
C510  100nF  C-EUC0603  [C0603]
C511  100nF  C-EUC0603  [C0603]
C512  100nF  C-EUC0603  [C0603]
C513  22µF  C-EUC0805  [C0805]
C514  22µF  C-EUC0805  [C0805]
C515  7pF  C-EUC0603  [C0603]
C516  7pF  C-EUC0603  [C0603]
C517  2.2µF  C-EUC0805  [C0805]
C518  330µF  CPOL-EUD  [PANASONIC_D]
J501  ICSP  5PIN-1.27  [5PIN-1.27]
J502  UART  PINHD-1X2  [1X02]
L501  10µH  RLB0912  [RLB0912]
R501  10kΩ  R-US_R0603  [R0603]
R502  1kΩ  R-US_R0603  [R0603]
R503  100kΩ  R-US_R0603  [R0603]
R504  8.2kΩ  R-US_R0603  [R0603]
R505  100kΩ  R-US_R0603  [R0603]
R506  20kΩ  R-US_R0603  [R0603]
R507  0Ω  R-US_R0603  [R0603]
SJ501  SJ  [SJ]
SJ502  SJ  [SJ]
SJ503  SJ  [SJ]
SJ504  SJ  [SJ]
TP501  RCU-0(J)  [TP_0603_JOINED]
TP502  RCU-0(J)  [TP_0603_JOINED]
TP503  RCU-0(J)  [TP_0603_JOINED]
TP504  RCU-0(J)  [TP_0603_JOINED]
TP505  RCU-0(J)  [TP_0603_JOINED]
TP506  RCU-0(J)  [TP_0603_JOINED]
TP507  RCU-0(J)  [TP_0603_JOINED]
TP508  RCU-0(J)  [TP_0603_JOINED]
TP509  RCU-0(J)  [TP_0603_JOINED]
U501  TPS54308  [SOT23-6L]
U502  PIC32MZ-EF-064  [TQFP64-10X10X1MM]
U503  LD39150DT33  DFN6-LDO  [DFN6]
XDS501  NHD-3.5-320240FT-FPCV  [FFC3A20-20]
Y501  24MHz  XRCGB-CRYSTAL  [XRCGB]

### Nets
3.3V: C505.1 C506.1 C507.1 C508.1 C510.1 C511.1 C512.1 C517.1 J501.2 R501.2 R507.2 TP501.1(TP) U502.8(VDD) U502.19(AVDD) U502.26(VDD) U502.34(VUSB3V3) U502.39(VDD) U502.54(VDD) U502.60(VDD) U503.4(OUT) U503.5(OUT) XDS501.A1(VDD) XDS501.A17(VBL) XDS501.A18(VBL) XDS501.B1(VDD) XDS501.B17(VBL) XDS501.B18(VBL) ; also sheet 3,4
3.3V_BULKR: C518.+ R507.1
3.6V: C513.1 C514.1 L501.2 R505.2 TP509.1(TP) U503.2(EN) U503.3(IN)
18V: C501.1 C504.1 R503.2 U501.3(VIN) ; also sheet 2,3,4
LCD_!CS: TP506.1(TP) U502.21(RB8) XDS501.A6(!CS) XDS501.B6(!CS)
LCD_!INT: TP507.1(TP) U502.18(RB7) XDS501.A7(!INT) XDS501.B7(!INT)
LCD_!PD: TP508.1(TP) U502.17(RB6) XDS501.A8(!PD) XDS501.B8(!PD)
LCD_MISO: TP504.1(TP) U502.23(RB10) XDS501.A4(MISO/IO1) XDS501.B4(MISO/IO1)
LCD_MOSI: TP505.1(TP) U502.22(RB9) XDS501.A5(MOSI/IO0) XDS501.B5(MOSI/IO0)
LCD_SCK: TP503.1(TP) U502.29(RB14) XDS501.A3(SCK) XDS501.B3(SCK)
PIC_!MCLR: J501.1 R502.1 U502.9(!MCLR)
PIC_!MCLR!_FILTER: C502.1 R501.1 R502.2
PIC_D+: SJ501.1 SJ503.1 U502.37(D+)
PIC_D-: SJ502.1 SJ504.1 U502.36(D-)
PIC_OSC1: C515.1 U502.31(RC12) Y501.1
PIC_OSC2: C516.1 U502.32(RC15) Y501.3
PIC_PGEC: J501.5 U502.15(RB1)
PIC_PGED: J501.4 U502.16(RB0)
PIC_UART_RX: J502.1 U502.6(RG8)
PIC_UART_TX: J502.2 U502.5(RG7)
PIC_VIN_SENSE: C503.1 R503.1 R504.2 TP502.1(TP) U502.11(RB5)
PRELIN_BOOT: C509.1 U501.6(BOOT)
PRELIN_FB: R505.1 R506.2 U501.4(FB)
PRELIN_SW: C509.2 L501.1 U501.2(SW)
SGND: C501.2 C502.2 C503.2 C504.2 C505.2 C506.2 C507.2 C508.2 C510.2 C511.2 C512.2 C513.2 C514.2 C515.2 C516.2 C517.2 C518.- J501.3 R504.1 R506.1 U501.1(GND) U502.7(VSS) U502.20(AVSS) U502.25(VSS) U502.35(VSS) U502.40(VSS) U502.55(VSS) U502.59(VSS) U503.1(GND) U503.T(GND) XDS501.A2(GND) XDS501.A19(GND_BL) XDS501.A20(GND_BL) XDS501.B2(GND) XDS501.B19(GND_BL) XDS501.B20(GND_BL) ; also sheet 2,3,4
USB1_!ALERT: U502.42(RF5) ; also sheet 3
USB1_DM: SJ502.2 ; also sheet 3
USB1_DP: SJ501.2 ; also sheet 3
USB1_EN: U502.45(RD11) ; also sheet 3
USB1_SCL: U502.44(RD10) ; also sheet 3
USB1_SDA: U502.43(RD9) ; also sheet 3
USB2_!ALERT: U502.49(RD1) ; also sheet 4
USB2_DM: SJ504.2 ; also sheet 4
USB2_DP: SJ503.2 ; also sheet 4
USB2_EN: U502.52(RD4) ; also sheet 4
USB2_SCL: U502.51(RD3) ; also sheet 4
USB2_SDA: U502.50(RD2) ; also sheet 4
Unconnected: U501.5(EN) U502.1(RE5) U502.2(RE6) U502.3(RE7) U502.4(RG6) U502.10(RG9) U502.12(RB4) U502.13(RB3) U502.14(RB2) U502.24(RB11) U502.27(RB12) U502.28(RB13) U502.30(RB15) U502.33(VBUS) U502.38(RF3) U502.41(RF4) U502.46(RD0) U502.47(RC13) U502.48(RC14) U502.53(RD5) U502.56(RF0) U502.57(RF1) U502.58(RE0) U502.61(RE1) U502.62(RE2) U502.63(RE3) U502.64(RE4) XDS501.A9(AUDIO_L) XDS501.A10(NC1) XDS501.A11(GPIO0/IO2) XDS501.A12(GPIO1/IO3) XDS501.A13(GPIO2) XDS501.A14(GPIO3) XDS501.B9(AUDIO_L) XDS501.B10(NC1) XDS501.B11(GPIO0/IO2) XDS501.B12(GPIO1/IO3) XDS501.B13(GPIO2) XDS501.B14(GPIO3)

## Library data of the parts
BR101 = BW-Active:GBU6*: Diode Bridge Rectifier
C101 C103 = BW-PassiveMechanical:C-EU-10MM-TH
C102 C106 = BW-PassiveMechanical:WCAP-FTX2: AC Safety Capacitors, 10mm pitch
C104 C105 C107-C113 C201-C209 C211-C221 C224-C227 C301-C318 C320 C322 C324 C325 C327-C331 C401-C418 C420 C422 C424 C425 C427-C431 C501-C517 = rcl:C-EU: CAPACITOR, European symbol; SPICEPREFIX: C
C114-C120 = BW-PassiveMechanical:CPOL-E5-12.5: Grid 5mm, diameter 12.5mm
C210 C222 C223 C319 C321 C323 C326 C419 C421 C423 C426 C518 = rcl:CPOL-EU: POLARIZED CAPACITOR, European symbol; SPICEPREFIX: C
D101 D201-D204 D208 = BW-Active:SOD123FL-DIODE
D102 D103 D205 D206 D209 D210 = BW-Active:SOD123-ZENER
D104 D105 = diode:DIODE-: DIODE
D207 = BW-Active:DO-214AC-SCHOTTKY
D301 D302 D401 D402 = BW-Active:SOD323-SCHOTTKY
F101 F201 = BW-PassiveMechanical:MRF_FUSE
J301 J401 = BW-Connectors:12401948E412A: USB 2.0 Type C jack
J501 = BW-Connectors:5PIN-1.27: 5 pin header with 1.27mm pitch
J502 = pinhead:PINHD-1X2: PIN HEADER
L101 = Eagle_WE-CMB (rev21d):WE-CMB_M: WE-CMB Common Mode Power Line Choke Characteristics Broadband filterring due to low capacitance winding technique High suppression of asymmetrical interferences also at low frequency range Very compact design Highest possible rated current by small size Operating temperature: –40 ºC to +125 ºC Flammability corresponding to UL 94 V-0 Climatic category: 40/125/21 Certified according to IEC 60938-2 Applications Power electronics Power line in- and output filter Filterring of devices without any ground connection Suppression of radio interferences in motors Suppression of common mode noise <https://www.we-online.com/catalog/media/o14763v209%20Family_WE-CMB_XS-XXL.jpg> Details see: https://www.we-online.com/katalog/en/WE-CMB Updated by Ella Wu 2020-12-07 2020 (C) Wurth Elektronik; DATASHEET-URL: https://www.we-online.com/catalog/datasheet/744823210.pdf; IR: 2A; MOUNT: THT; PART-NUMBER: 744823210; RDC: 125mOhm; VR: 250 V (AC); VT: 1500 V (AC)
L102 = BW-PassiveMechanical:ATCA-08: Very high current toroidal inductor
L201 = BW-PassiveMechanical:HCTI*: High Current Toroidal Inductor
L301 L401 = BW-PassiveMechanical:B82559B*A016: Very high current inductor, low value
L501 = BW-PassiveMechanical:RLB0912: Low-med current inductor
LSP101 LSP102 = solpad:LSP13: SOLDER PAD drill 1.3 mm, distributor Buerklin, 12H562
OP201 = BW-Active:DIP4-OPTOCOUPLER: Optocoupler in DIP4 package
Q101 Q201 Q202 = BW-Active:TO220BV-HS1-N-MOSFET
Q203 Q204 = BW-Active:POWERPAK-SO8-N-MOSFET
Q301-Q304 Q401-Q404 = BW-Active:TSDSON-8-N-MOSFET
R101-R113 R201-R243 R301-R319 R401-R419 = rcl:R-US_: RESISTOR, American symbol; SPICEPREFIX: R
R501-R507 = resistor:R-US_: RESISTOR, American symbol
RT101 = varistor:THERMISTOR: THERMISTOR
RV101 = BW-PassiveMechanical:B72207S0271: 275V Metal Oxide Varistor
SJ501-SJ504 = jumper:SJ: SMD solder JUMPER
T201 = BW-PassiveMechanical:ETD29/16/10*: Self-wound Transformer/Inductor
TP101 TP201 TP202 TP301-TP306 TP401-TP406 TP501-TP509 = BW-PassiveMechanical:RCU-0: Solderable probe pad in 0603 form
U101 = BW-Active:UCC28056*: Transition-Mode PFC Boost Controller
U201 = BW-Active:UCC25640*: LLC Resonant Controller
U202 = BW-Active:TLV431: Shunt regulator
U203 = BW-Active:UCC24624: Dual Channel Synchronous Rectifier Controller for LLC Resonant Converters
U301 U401 = BW-Active:MAX25432: 100W USB PD PPS Buck-Boost Port Controller and Protector; COPYRIGHT: Copyright (C) 2023 Ultra Librarian. All rights reserved.; MANUFACTURER_PART_NUMBER: MAX25432BATLG/V+; MFR_NAME: Analog Devices Inc
U501 = BW-Active:TPS54308: 3A FCCM Step-Down Converter
U502 = BW-Active:PIC32MZ-EF-064: 32-bit 200MHz microcontroller, 64-pin
U503 = BW-Active:DFN6-LDO
XDS501 = BW-Active:NHD-3.5-320240FT: SPI 3.5" LCD, 320x240, resistive touch
Y501 = BW-PassiveMechanical:XRCGB-CRYSTAL

## Net classes
1 HV: clearance 4 mm to class 0
2 primary: clearance 4 mm to class 0